# Altium schematic sheet FEU31_Part2.SchDoc: Скальпель
size A3; Address1: (с) Быканов Андрей; Address2: г.Тула 2016г.; Revision: 1.3
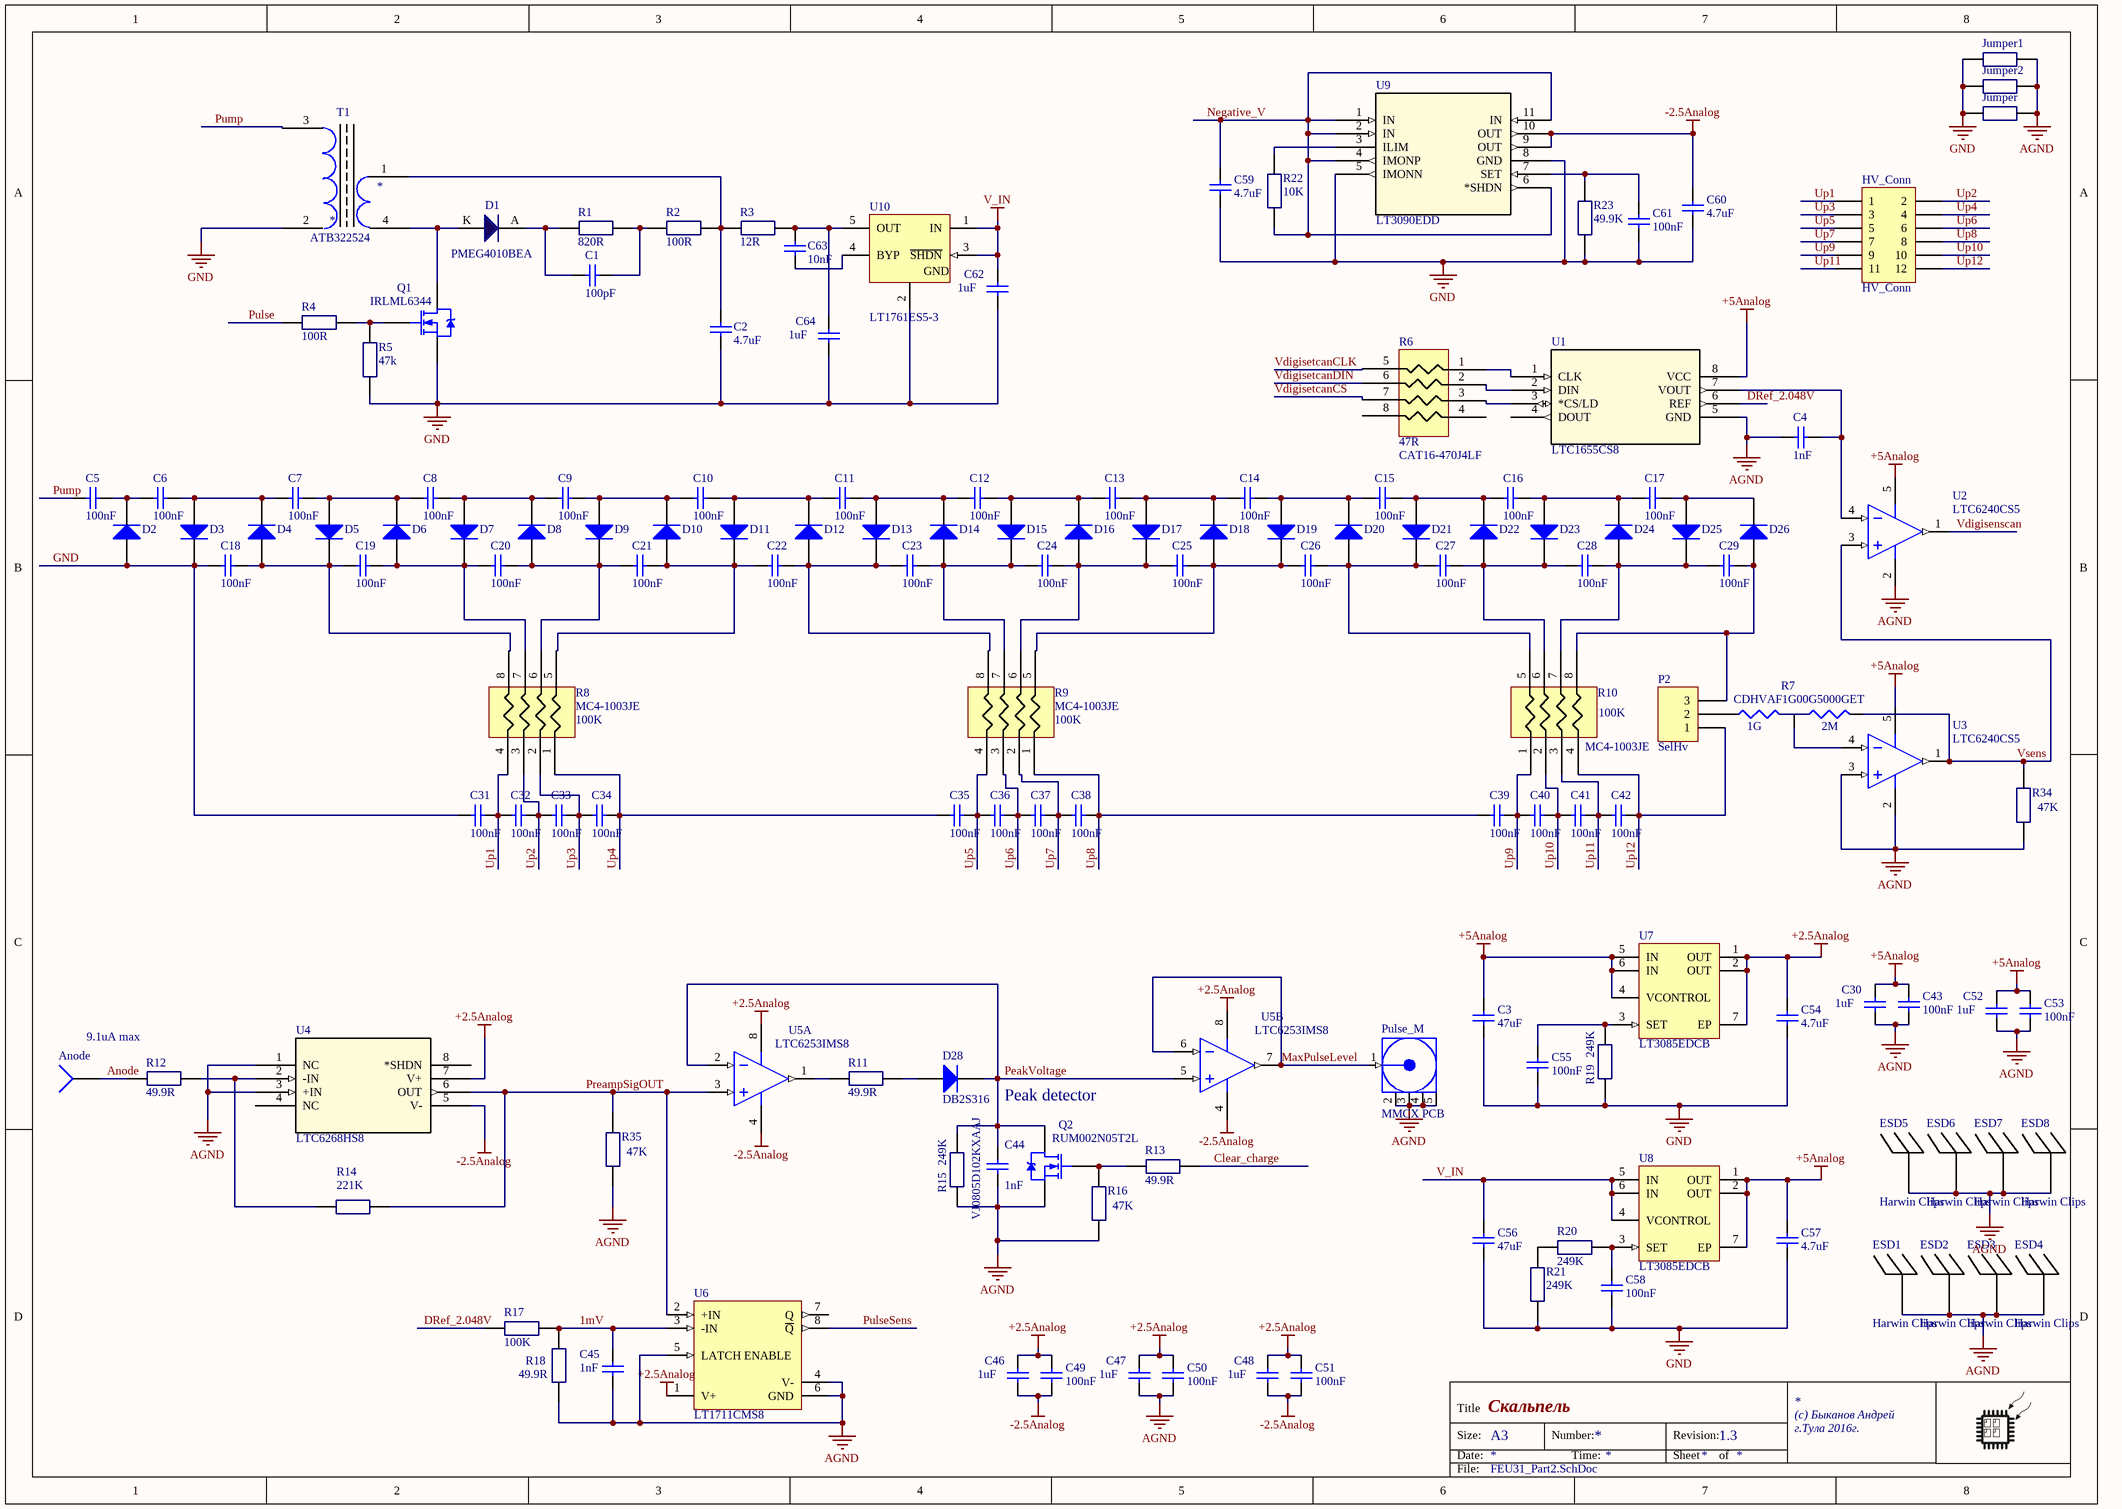
[diagram p0: FEU31_Part2.SchDoc]

## Parts
Anode  Anode  [PMTanode]  (value not drawn)  (no BOM)
C1  100pF  [1608[0603]_CAP]
C2  4.7uF  [C1206]
C3  47uF  [C1206]
C4  1nF  [1608[0603]_CAP]
C5  100nF  [C1206]
C6  100nF  [C1206]
C7  100nF  [C1206]
C8  100nF  [C1206]
C9  100nF  [C1206]
C10  100nF  [C1206]
C11  100nF  [C1206]
C12  100nF  [C1206]
C13  100nF  [C1206]
C14  100nF  [C1206]
C15  100nF  [C1206]
C16  100nF  [C1206]
C17  100nF  [C1206]
C18  100nF  [C1206]
C19  100nF  [C1206]
C20  100nF  [C1206]
C21  100nF  [C1206]
C22  100nF  [C1206]
C23  100nF  [C1206]
C24  100nF  [C1206]
C25  100nF  [C1206]
C26  100nF  [C1206]
C27  100nF  [C1206]
C28  100nF  [C1206]
C29  100nF  [C1206]
C30  1uF  [1608[0603]_CAP]
C31  100nF  [C1206]
C32  100nF  [C1206]
C33  100nF  [C1206]
C34  100nF  [C1206]
C35  100nF  [C1206]
C36  100nF  [C1206]
C37  100nF  [C1206]
C38  100nF  [C1206]
C39  100nF  [C1206]
C40  100nF  [C1206]
C41  100nF  [C1206]
C42  100nF  [C1206]
C43  100nF  [1608[0603]_CAP]
C44  Order: VJ0805D102KXAAJ  [0805_CAP]  (hidden comment: 1nF)
C45  1nF  [1608[0603]_CAP]
C46  1uF  [1608[0603]_CAP]
C47  1uF  [1608[0603]_CAP]
C48  1uF  [1608[0603]_CAP]
C49  100nF  [1608[0603]_CAP]
C50  100nF  [1608[0603]_CAP]
C51  100nF  [1608[0603]_CAP]
C52  1uF  [1608[0603]_CAP]
C53  100nF  [1608[0603]_CAP]
C54  4.7uF  [C1206]
C55  100nF  [1608[0603]_CAP]
C56  47uF  [C1206]
C57  4.7uF  [C1206]
C58  100nF  [1608[0603]_CAP]
C59  4.7uF  [C1206]
C60  4.7uF  [C1206]
C61  100nF  [1608[0603]_CAP]
C62  1uF  [1608[0603]_CAP]
C63  10nF  [1608[0603]_CAP]
C64  1uF  [1608[0603]_CAP]
D1  PMEG4010BEA  [PMEG4010BEA]
D2  (no value)  [DA2JF8100L]
D3  (no value)  [DA2JF8100L]
D4  (no value)  [DA2JF8100L]
D5  (no value)  [DA2JF8100L]
D6  (no value)  [DA2JF8100L]
D7  (no value)  [DA2JF8100L]
D8  (no value)  [DA2JF8100L]
D9  (no value)  [DA2JF8100L]
D10  (no value)  [DA2JF8100L]
D11  (no value)  [DA2JF8100L]
D12  (no value)  [DA2JF8100L]
D13  (no value)  [DA2JF8100L]
D14  (no value)  [DA2JF8100L]
D15  (no value)  [DA2JF8100L]
D16  (no value)  [DA2JF8100L]
D17  (no value)  [DA2JF8100L]
D18  (no value)  [DA2JF8100L]
D19  (no value)  [DA2JF8100L]
D20  (no value)  [DA2JF8100L]
D21  (no value)  [DA2JF8100L]
D22  (no value)  [DA2JF8100L]
D23  (no value)  [DA2JF8100L]
D24  (no value)  [DA2JF8100L]
D25  (no value)  [DA2JF8100L]
D26  (no value)  [DA2JF8100L]
D28  DB2S316  [SSMini2-F5-B]
ESD1  Harwin Clips  [HARWIN - S0981-46R - CLIP]
ESD2  Harwin Clips  [HARWIN - S0981-46R - CLIP]
ESD3  Harwin Clips  [HARWIN - S0981-46R - CLIP]
ESD4  Harwin Clips  [HARWIN - S0981-46R - CLIP]
ESD5  Harwin Clips  [HARWIN - S0981-46R - CLIP]
ESD6  Harwin Clips  [HARWIN - S0981-46R - CLIP]
ESD7  Harwin Clips  [HARWIN - S0981-46R - CLIP]
ESD8  Harwin Clips  [HARWIN - S0981-46R - CLIP]
HV_Conn  HV_Conn  [HDR2X6H]  (no BOM)
Jumper  (no value)  [0402 jumper]  (net tie, no BOM)
Jumper1  (no value)  [0402 jumper]  (net tie, no BOM)
Jumper2  (no value)  [0402 jumper]  (net tie, no BOM)
P2  SelHv  [HDR1X3]  (no BOM)
Pulse_M  MMCX PCB  [MMCX2.54-V5]
Q1  IRLML6344  [SOT-23_N]
Q2  RUM002N05T2L  [RUM002N05]
R1  820R  [1608[0603]_RES]
R2  100R  [1608[0603]_RES]
R3  12R  [1608[0603]_RES]
R4  100R  [1608[0603]_RES]
R5  47k  [1608[0603]_RES]
R6  47R  [CAT16-470J4LF]
R7  value 1G  Value2: 2M  [CDHV2512]  (hidden comment: CDHVAF1G00G5000GET)
R8  MC4-1003JE  value 100K  [MC4]
R9  MC4-1003JE  value 100K  [MC4]
R10  MC4-1003JE  value 100K  [MC4]
R11  49.9R  [1608[0603]_RES]
R12  49.9R  [1608[0603]_RES]
R13  49.9R  [1608[0603]_RES]
R14  221K  [1608[0603]_RES]
R15  249K  [1608[0603]_RES]
R16  47K  [1608[0603]_RES]
R17  100K  [1608[0603]_RES]
R18  49.9R  [1608[0603]_RES]
R19  249K  [1608[0603]_RES]
R20  249K  [1608[0603]_RES]
R21  249K  [1608[0603]_RES]
R22  10K  [1608[0603]_RES]
R23  49.9K  [1608[0603]_RES]
R34  47K  [1608[0603]_RES]
R35  47K  [1608[0603]_RES]
T1  ATB322524  [ATB322515-0110]
U1  LTC1655CS8  [SO-8_S]
U2  LTC6240CS5  [LT-S5-5-TSOT-23_N]
U3  LTC6240CS5  [LT-S5-5-TSOT-23_N]
U4  LTC6268HS8  [SO-8_S]
U5  LTC6253IMS8  [LT-MS8-8_N]  (parts A,B of 2)
U6  LT1711CMS8  [LT-MS8_N]
U7  LT3085EDCB  [LT-DCB-6_V]
U8  LT3085EDCB  [LT-DCB-6_V]
U9  LT3090EDD  [DFN-10_DD]
U10  LT1761ES5-3  [LT-S5-5-TSOT-23_N]

## Nets
+2.5Analog: C46.1 C47.1 C48.1 C49.1 C50.1 C51.1 C54.1 U4.7(V+) U5.8(V+) U6.1(V+) U7.1(OUT) U7.2(OUT) U7.7(EP)
+5Analog: C3.1 C30.1 C43.1 C52.1 C53.1 C57.1 U1.8(VCC) U2.5(V+) U3.5(V+) U7.4(VCONTROL) U7.5(IN) U7.6(IN) U8.1(OUT) U8.2(OUT) U8.7(EP)
-2.5Analog: C46.2 C48.2 C49.2 C51.2 C60.1 U4.5(V-) U5.4(V-) U9.9(OUT) U9.10(OUT)
AGND: C4.1 C30.2 C43.2 C44.2 C45.2 C47.2 C50.2 C52.2 C53.2 ESD1.1 ESD2.1 ESD3.1 ESD4.1 ESD5.1 ESD6.1 ESD7.1 ESD8.1 Jumper.2 Jumper1.2 Jumper2.2 Pulse_M.2(GND) Pulse_M.3(GND) Pulse_M.4(GND) Pulse_M.5(GND) Q2.2(S) R15.2 R16.2 R18.2 R34.2 R35.2 U1.5(GND) U2.2(V-) U3.2(V-) U3.3(+IN) U4.1(NC) U4.3(+IN) U6.4(V-) U6.5(LATCH_ENABLE) U6.6(GND)
GND: C2.2 C3.2 C18.2 C31.2 C54.2 C55.2 C56.2 C57.2 C58.2 C59.2 C60.2 C61.2 C62.2 C64.2 D2.1(A) D3.2(K) Jumper.1(A) Jumper1.1(A) Jumper2.1(A) Q1.2(S) R5.1(A) R19.2 R21.1(A) R23.1(A) T1.2 U9.5(IMONN) U9.8(GND) U10.2(GND)
V_IN: C56.1 C62.1 U8.4(VCONTROL) U8.5(IN) U8.6(IN) U10.1(IN) U10.3(~{SHDN})
1mV: C45.1 R17.2 R18.1(A) U6.3(-IN)
Anode: Anode.1 R12.1(A)
Clear_charge: R13.2
DRef_2.048V: R17.1(A) U1.6(REF)
MaxPulseLevel: Pulse_M.1(Signal) U5.6(-IN_B) U5.7(OUT_B)
Negative_V: C59.1 R22.1(A) U9.1(IN) U9.2(IN) U9.4(IMONP) U9.6(*SHDN) U9.11(IN)
PeakVoltage: C44.1 D28.2(K) Q2.3(D) R15.1(A) U5.2(-IN_A) U5.5(+IN_B)
PreampSigOUT: R14.1(A) R35.1(A) U4.6(OUT) U5.3(+IN_A) U6.2(+IN)
Pulse: R4.1(A)
PulseSens: U6.8(~{Q})
Pump: C5.2 T1.3
Up1: C31.1 C32.2 HV_Conn.1 R8.4
Up2: C32.1 C33.2 HV_Conn.2 R8.3
Up3: C33.1 C34.2 HV_Conn.3 R8.2
Up4: C34.1 C35.2 HV_Conn.4 R8.1
Up5: C35.1 C36.2 HV_Conn.5 R9.4
Up6: C36.1 C37.2 HV_Conn.6 R9.3
Up7: C37.1 C38.2 HV_Conn.7 R9.2
Up8: C38.1 C39.2 HV_Conn.8 R9.1
Up9: C39.1 C40.2 HV_Conn.9 R10.1
Up10: C40.1 C41.2 HV_Conn.10 R10.2
Up11: C41.1 C42.2 HV_Conn.11 R10.3
Up12: C42.1 HV_Conn.12 P2.1 R10.4
Vdigisenscan: U2.1(OUT)
VdigisetcanCLK: R6.5
VdigisetcanCS: R6.7
VdigisetcanDIN: R6.6
Vsens: R7.2 R34.1(A) U2.3(+IN) U3.1(OUT)
NetC1_1: C1.1 D1.A R1.1(A)
NetC1_2: C1.2 R1.2 R2.1(A)
NetC2_1: C2.1 R2.2 R3.1(A) T1.1
NetC4_2: C4.2 U1.7(VOUT) U2.4(-IN)
NetC5_1: C5.1 C6.2 D2.2(K)
NetC6_1: C6.1 C7.2 D3.1(A) D4.2(K)
NetC7_1: C7.1 C8.2 D5.1(A) D6.2(K)
NetC8_1: C8.1 C9.2 D7.1(A) D8.2(K)
NetC9_1: C9.1 C10.2 D9.1(A) D10.2(K)
NetC10_1: C10.1 C11.2 D11.1(A) D12.2(K)
NetC11_1: C11.1 C12.2 D13.1(A) D14.2(K)
NetC12_1: C12.1 C13.2 D15.1(A) D16.2(K)
NetC13_1: C13.1 C14.2 D17.1(A) D18.2(K)
NetC14_1: C14.1 C15.2 D19.1(A) D20.2(K)
NetC15_1: C15.1 C16.2 D21.1(A) D22.2(K)
NetC16_1: C16.1 C17.2 D23.1(A) D24.2(K)
NetC17_1: C17.1 D25.1(A) D26.2(K)
NetC18_1: C18.1 C19.2 D4.1(A) D5.2(K) R8.8
NetC19_1: C19.1 C20.2 D6.1(A) D7.2(K) R8.7
NetC20_1: C20.1 C21.2 D8.1(A) D9.2(K) R8.6
NetC21_1: C21.1 C22.2 D10.1(A) D11.2(K) R8.5
NetC22_1: C22.1 C23.2 D12.1(A) D13.2(K) R9.8
NetC23_1: C23.1 C24.2 D14.1(A) D15.2(K) R9.7
NetC24_1: C24.1 C25.2 D16.1(A) D17.2(K) R9.6
NetC25_1: C25.1 C26.2 D18.1(A) D19.2(K) R9.5
NetC26_1: C26.1 C27.2 D20.1(A) D21.2(K) R10.5
NetC27_1: C27.1 C28.2 D22.1(A) D23.2(K) R10.6
NetC28_1: C28.1 C29.2 D24.1(A) D25.2(K) R10.7
NetC29_1: C29.1 D26.1(A) P2.3 R10.8
NetC55_1: C55.1 R19.1(A) U7.3(SET)
NetC58_1: C58.1 R20.2 U8.3(SET)
NetC61_1: C61.1 R23.2 U9.7(SET)
NetC63_1: C63.1 U10.4(BYP)
NetC63_2: C63.2 C64.1 R3.2 U10.5(OUT)
NetD1_K: D1.K Q1.3(D) T1.4
NetD28_1: D28.1(A) R11.2
NetP2_2: P2.2 R7.1
NetQ1_1: Q1.1(G) R4.2 R5.2
NetQ2_1: Q2.1(G) R13.1(A) R16.1(A)
NetR6_1: R6.1 U1.1(CLK)
NetR6_2: R6.2 U1.2(DIN)
NetR6_3: R6.3 U1.3(*CS/LD)
NetR7_3: R7.3 U3.4(-IN)
NetR11_1: R11.1(A) U5.1(OUT_A)
NetR12_2: R12.2 R14.2 U4.2(-IN)
NetR20_1: R20.1(A) R21.2
NetR22_2: R22.2 U9.3(ILIM)

Not connected (* = marked no-connect by the designer): R6 4 8; U1 4(DOUT); U4 4(NC) 8(*SHDN); U6 7(Q)

## Notes on the sheet
- 9.1uA max
- Peak detector
- Title
- Size:
- Date:
- A3
- Number:
- Time:
- Revision:
- Sheet
- of
- File:

## Library data of the parts
Anode = Socket: LatestRevisionDate: 17-Jul-2002; LatestRevisionNote: Re-released for DXP Platform.; Publisher: Altium Limited
C1 = Cap Semi: Capacitor (Semiconductor SIM Model); Order: CC0603JRNPO9BN101; Published: 8-Jun-2000; LatestRevisionDate: 29-May-2009; LatestRevisionNote: IPC-7351 Footprint Added.; PackageReference: C1206; Publisher: Altium Limited; PackageDescription: Chip Capacitor; Value: 100pF
C2 C54 C57 C59 C60 = Cap Semi: Capacitor (Semiconductor SIM Model); Order: GRM31CR71A475KA01L; Published: 8-Jun-2000; LatestRevisionDate: 29-May-2009; LatestRevisionNote: IPC-7351 Footprint Added.; PackageReference: C1206; Publisher: Altium Limited; PackageDescription: Chip Capacitor; Value: 4.7uF
C3 C56 = Cap Semi: Capacitor (Semiconductor SIM Model); Order: GRM31CR61A476ME15L; Published: 8-Jun-2000; LatestRevisionDate: 29-May-2009; LatestRevisionNote: IPC-7351 Footprint Added.; PackageReference: C1206; Publisher: Altium Limited; PackageDescription: Chip Capacitor; Value: 47uF
C4 C45 = Cap Semi: Capacitor (Semiconductor SIM Model); Order: CC0603JRNPO9BN102; Published: 8-Jun-2000; LatestRevisionDate: 29-May-2009; LatestRevisionNote: IPC-7351 Footprint Added.; PackageReference: C1206; Publisher: Altium Limited; PackageDescription: Chip Capacitor; Value: 1nF
C5-C29 C31-C42 = Cap Semi: Capacitor (Semiconductor SIM Model); Order: CGA5L4X7T2W104K; Published: 8-Jun-2000; LatestRevisionDate: 29-May-2009; LatestRevisionNote: IPC-7351 Footprint Added.; PackageReference: C1206; Publisher: Altium Limited; PackageDescription: Chip Capacitor; Value: 100nF
C30 C46-C48 C52 C62 C64 = Cap Semi: Capacitor (Semiconductor SIM Model); Order: CC0603KRX5R7BB105; Published: 8-Jun-2000; LatestRevisionDate: 29-May-2009; LatestRevisionNote: IPC-7351 Footprint Added.; PackageReference: C1206; Publisher: Altium Limited; PackageDescription: Chip Capacitor; Value: 1uF
C43 C49-C51 C53 C55 C58 C61 = Cap Semi: Capacitor (Semiconductor SIM Model); Order: CC0603KRX7R8BB104; Published: 8-Jun-2000; LatestRevisionDate: 29-May-2009; LatestRevisionNote: IPC-7351 Footprint Added.; PackageReference: C1206; Publisher: Altium Limited; PackageDescription: Chip Capacitor; Value: 100nF
C44 = Cap Semi: Capacitor (Semiconductor SIM Model); Published: 8-Jun-2000; LatestRevisionDate: 29-May-2009; LatestRevisionNote: IPC-7351 Footprint Added.; PackageReference: C1206; Publisher: Altium Limited; PackageDescription: Chip Capacitor; Value: 1nF
C63 = Cap Semi: Capacitor (Semiconductor SIM Model); Order: GRM188R71H103KA01D; Published: 8-Jun-2000; LatestRevisionDate: 29-May-2009; LatestRevisionNote: IPC-7351 Footprint Added.; PackageReference: C1206; Publisher: Altium Limited; PackageDescription: Chip Capacitor; Value: 10nF
D2-D26 = Diode: Default Diode; Value: DA2JF8100L; Published: 8-Jun-2000; LatestRevisionDate: 17-Jul-2002; LatestRevisionNote: Re-released for DXP Platform.; PackageVersion: Sep-1996; PackageReference: SMC; Publisher: Altium Limited; PackageDescription: DO-214-AB/SMC; 2 C-Bend Leads; Body 7.9 x 5.9 mm, inc. leads (LxW); Code_JEDEC: DO-214-AB; Order: DA2JF8100L
D28 = Diode: Default Diode; Published: 8-Jun-2000; LatestRevisionDate: 17-Jul-2002; LatestRevisionNote: Re-released for DXP Platform.; PackageVersion: Sep-1996; PackageReference: SMC; Publisher: Altium Limited; PackageDescription: DO-214-AB/SMC; 2 C-Bend Leads; Body 7.9 x 5.9 mm, inc. leads (LxW); Code_JEDEC: DO-214-AB; Order: DB2S316; Value: DB2S316
ESD1-ESD8 = Harwin Clips: Order: S0981-46R
HV_Conn = Header 6X2H: Header, 6-Pin, Dual row, Right Angle; LatestRevisionDate: 17-Jul-2002; LatestRevisionNote: Re-released for DXP Platform.; Publisher: Altium Limited
Jumper Jumper1 Jumper2 = Resistor 0805: Avail: 20
P2 = Header 3: Header, 3-Pin; LatestRevisionDate: 17-Jul-2002; LatestRevisionNote: Re-released for DXP Platform.; Publisher: Altium Limited
Pulse_M = COAX-M: RF Coaxial PCB Connector, MMCX; Thru-Hole, Vertical Mount Plug,  50 Ohm Impedance; PackageDocument: Rev. A, 16-Jun-1997; PCB_Layout: Complies with manufacturer's recommendation.; DrillSize: Corresponds to nominal value.; Published: 15-Jul-2004; LatestRevisionDate: 15-Jul-2004; LatestRevisionNote: Component Replaced.; DatasheetDocument: 30-May-2003; PackageReference: 908-21103; Publisher: Altium Limited; ComponentLink1Description: Manufacturer Link; ComponentLink1URL: http://www.amphenolrf.com/; Order: MMCX PCB
Q1 Q2 = IRLML2402: HEXFET Power MOSFET; Published: 8-Jun-2000; LatestRevisionDate: 20-Nov-2009; LatestRevisionNote: IPC-7351 Footprint Added.; DatasheetVersion: Aug-1997; PackageReference: SOT-23; Publisher: Altium Limited; PackageDescription: 3-Pin SOT-23 Package 0.95 mm Pitch, 2.3 mm Lead Span; ComponentLink1Description: Manufacturer Link; ComponentLink1URL: http://www.irf.com/; ComponentLink2Description: Datasheet; ComponentLink2URL: http://www.irf.com/product-info/datasheets/data/irlml2402.pdf
  Q1: Order: IRLML6344
  Q2: Order: RUM002N05T2L; Value: RUM002N05T2L
R1 = Resistor 0805: Order: RC0603JR-07820RL; Avail: 20; Value: 820R
R2 R4 = Resistor 0805: Order: RC0603JR-07100RL; Avail: 20; Value: 100R
R3 = Resistor 0805: Order: RC0603JR-0712RL; Avail: 20; Value: 12R
R5 R16 R34 R35 = Resistor 0805: Order: ERA-3AEB473V; Avail: 20
  R5: Value: 47k
  R16 R34 R35: Value: 47K
R6 R8-R10 = CAT16-470J4LF
  R6: Order: CAT16-470J4LF; Value: 47R
  R8-R10: Order: MC4-1003JE
R11-R13 R18 = Resistor 0805: Order: ERA-3AEB49R9V; Avail: 20; Value: 49.9R
R14 = Resistor 0805: Order: ERA-3AEB2213V; Avail: 20; Value: 221K
R15 R19-R21 = Resistor 0805: Order: ERA-3AEB2493V; Avail: 20; Value: 249K
R17 = Resistor 0805: Order: ERA-3AEB104V; Avail: 20; Value: 100K
R22 = Resistor 0805: Order: ERA-3AEB103V; Avail: 20; Value: 10K
R23 = Resistor 0805: Order: ERA-3AEB4992V; Avail: 20; Value: 49.9K
T1 = ATB322515-0110: Order: ATB322524
U1 = LTC1655CS8: Imported; Vendor: Linear Technology; Manufacturer_Part_Number: ltc1655cs8; Value: LTC1655CS8; Type: Type; RefDes: RefDes; Order: LTC1655CS8
U2 U3 = LTC6240CS5#PBF: Single Channel, Low Noise, CMOS Operational Amplifier, RRO, 18 MHz Typical GBW, 10 V/us Typical SR, 2.8 to 6 V, 5-Pin SOT23 (S5-5), Commercial, Pb-Free; Manufacturer: Linear Technology; Channels (#): 1; GBW (MHz) Typical: 18; Is (mA) Typical: 2; SR (V/us) Typical: 10; Vos (mV) Typical: 0.04; Vs Max (V): 6; Vs Min (V): 2.8; DatasheetVersion: Rev. E; PackageReference: LT-S5-5-TSOT-23; PackageDescription: 5-Lead Plastic TSOT-23, Body 1.63 x 2.90 mm, Pitch 0.95 mm; Supplier 1: Newark; Supplier Part Number 1: 13T9179; Linear Technology Part Number: LTC6240; RoHS: Pb-Free; Type: VFB; Mounting Technology: Surface Mount; Code_JEDEC: MO-193; PartNumber: LTC6240CS5#PBF; ComponentLink1Description: Manufacturer URL; ComponentLink1URL: http://www.linear.com/; ComponentLink2Description: Datasheet; ComponentLink2URL: http://cds.linear.com/docs/en/datasheet/624012fe.pdf; ComponentLink3Description: Package Specification; ComponentLink3URL: http://cds.linear.com/docs/en/packaging/SOT_5_05-08-1635.pdf; Order: LTC6240CS5
U4 = LTC6268HS8PBF: Imported; Manufacturer_Part_Number: ltc6268hs8#pbf; Vendor: Linear Technology; Value: Value; Type: Type; RefDes: RefDes; Order: LTC6268HS8
U5 = LTC6253IMS8#PBF: Dual Channel, Power Efficient Operational Amplifier, RRIO, 720 MHz Typical GBW, 280 V/us Typical SR, 2.5 to 5.25 V, 8-Pin SOP (MS8-8), Industrial, Pb-Free; Manufacturer: Linear Technology; Channels (#): 2; GBW (MHz) Typical: 720; Is (mA) Typical: 3.3; SR (V/us) Typical: 280; Vos (mV) Typical: 0.05; Vs Max (V): 5.25; Vs Min (V): 2.5; DatasheetVersion: Rev. C; PackageVersion: Rev G; PackageReference: LT-MS8-8; PackageDescription: 8-Lead Plastic Small Outline, Body 3.9 x 4.9 mm, Pitch 1.27 mm; Supplier 1: Digi-Key; Supplier Part Number 1: LTC6253IMS8#PBF-ND; Supplier 2: Newark; Supplier Part Number 2: 13T4062; Linear Technology Part Number: LTC6253; RoHS: Pb-Free; Type: VFB; Mounting Technology: Surface Mount; PartNumber: LTC6253IMS8#PBF; ComponentLink1Description: Manufacturer URL; ComponentLink1URL: http://www.linear.com/; ComponentLink2Description: Datasheet; ComponentLink2URL: http://cds.linear.com/docs/en/datasheet/625234fc.pdf; ComponentLink3Description: Package Specification; ComponentLink3URL: http://cds.linear.com/docs/en/packaging/05081610_G_SO8.pdf; Order: LTC6253IMS8
U6 = LT1711CMS8: 4.5 ns, 3 V / 5 V / + / - 5 V, Rail-to-Rail Comparator, 1 Channel, 2.4 to 12 V or + / - 2.4 to + / - 6 V, 0 to +70 degC, 8-pin Plastic MSOP (MS8); Generic Part Number: LT1711; Manufacturer: Linear Technology; Channels (#): 1; Prop Delay (us): 0.0045; Supply Current (uA) Typical: 10000; Vos (mV) Guaranteed: 5; Vos (mV) Typical: 0.5; Vs Max (V): 12; Vs Min (V): 2.4; PackageReference: MS8; PackageDescription: 8-Pin Plastic MSOP, Body 3 x 3 mm, Pitch 0.65 mm; Supplier 1: Digi-Key; Supplier Part Number 1: LT1711CMS8-ND; Supplier 2: Newark; Supplier Part Number 2: 57M5750; Features: Comparator, Rail-to-Rail In/Out, Output Latch; RoHS: N; Supply Voltage Range: 2.4 to 12 V or + / -2.4 to + / -6 V; Mounting Technology: Surface Mount; PartNumber: LT1711CMS8; ComponentLink1Description: Manufacturer URL; ComponentLink1URL: http://www.linear.com/; ComponentLink2Description: Datasheet; ComponentLink2URL: http://cds.linear.com/docs/en/datasheet/171112f.pdf; ComponentLink3Description: Package Specification; ComponentLink3URL: http://cds.linear.com/docs/en/packaging/MSOP_8_05-08-1660.pdf; Order: LT1711CMS8
U7 U8 = LT3085EDCB#PBF: Adjustable 500 mA Single Resistor Low Dropout Regulator, 0.3 mA Isupply, 6-pin SON (DCB-6), -40 to 125 degC, Pb-Free; Manufacturer: Linear Technology; Extended Temp: E, I, MP; Initial Accuracy(%): 1; Isupply(mA): 0.3; Vin Max(V): 36; Vin Min(V): 1.2; DatasheetVersion: Rev. B; PackageVersion: Rev. A, 03/2011; PackageReference: DCB-6; PackageDescription: 6-Pin Plastic DFN, Body 2 x 3 mm, Pitch 0.5 mm; Supplier 1: Farnell; Supplier Part Number 1: 2308197; Supplier 2: Newark; Supplier Part Number 2: 78T3981; RoHS: TRUE; Mounting Technology: Surface Mount; Code_JEDEC: MO-229; PartNumber: LT3085EDCB#PBF; ComponentLink1Description: Manufacturer URL; ComponentLink1URL: http://www.linear.com/; ComponentLink2Description: Datasheet; ComponentLink2URL: http://cds.linear.com/docs/en/datasheet/3085fb.pdf; ComponentLink3Description: Package Specification; ComponentLink3URL: http://www.linear.com/docs/en/packaging/(DCB6)%20DFN%2005-08-1715%20Rev%20A.pdf; Order: LT3085EDCB
U9 = LT3090EDDPBF: Imported; Manufacturer_Part_Number: lt3090edd#pbf; Vendor: Linear Technology; Value: Value; Type: Type; RefDes: RefDes; Order: LT3090EDD
U10 = LT1761ES5-3: 100 mA, Low Noise, LDO Micropower Regulator, 1.8 to 20 V Vin, 3 V Vout, 5-pin SOT23 (S5-5), -40 to 125 degC; Manufacturer: Linear Technology; Discrete Pass Element: no; Dropout Voltage(V): 0.3; Iout(mA): 100; Isupply(mA): 0.02; Noise(uV): 20; Number of Outputs: 1; Output Voltage: 3 V; PSRR(dB): 65; Vin Min(V): 1.8; DatasheetVersion: Rev. F; PackageVersion: Jun-10; PackageReference: S5-5; PackageDescription: 5-Pin Plastic TSOT-23, Body 1.63 x 2.90 mm, Pitch 0.95 mm; RoHS: FALSE; Shutdown Current(uA): 1; Vin Max(V): 20; Mounting Technology: Surface Mount; Code_JEDEC: MO-193; PartNumber: LT1761ES5-3; ComponentLink1Description: Manufacturer URL; ComponentLink1URL: http://www.linear.com/; ComponentLink2Description: Datasheet; ComponentLink2URL: http://cds.linear.com/docs/en/datasheet/1761sff.pdf; ComponentLink3Description: Package Specification; ComponentLink3URL: http://cds.linear.com/docs/en/packaging/SOT_5_05-08-1635.pdf; Order: LT1761ES5-3
D1 = PMEG4010BEA: Order: PMEG4010BEA; Value: PMEG4010BEA
R7 = CDHVAF1G00G5000GET: Published: 8-Jun-2000; LatestRevisionDate: 29-May-2009; LatestRevisionNote: IPC-7351 Footprint Added.; PackageReference: J1-0603; Publisher: Altium Limited; PackageDescription: Chip Resistor; Order: CDHVAF1G00G5000GET